# EAGLE design senseBox-HDC1080_v20 (EAGLE 7.7.0)
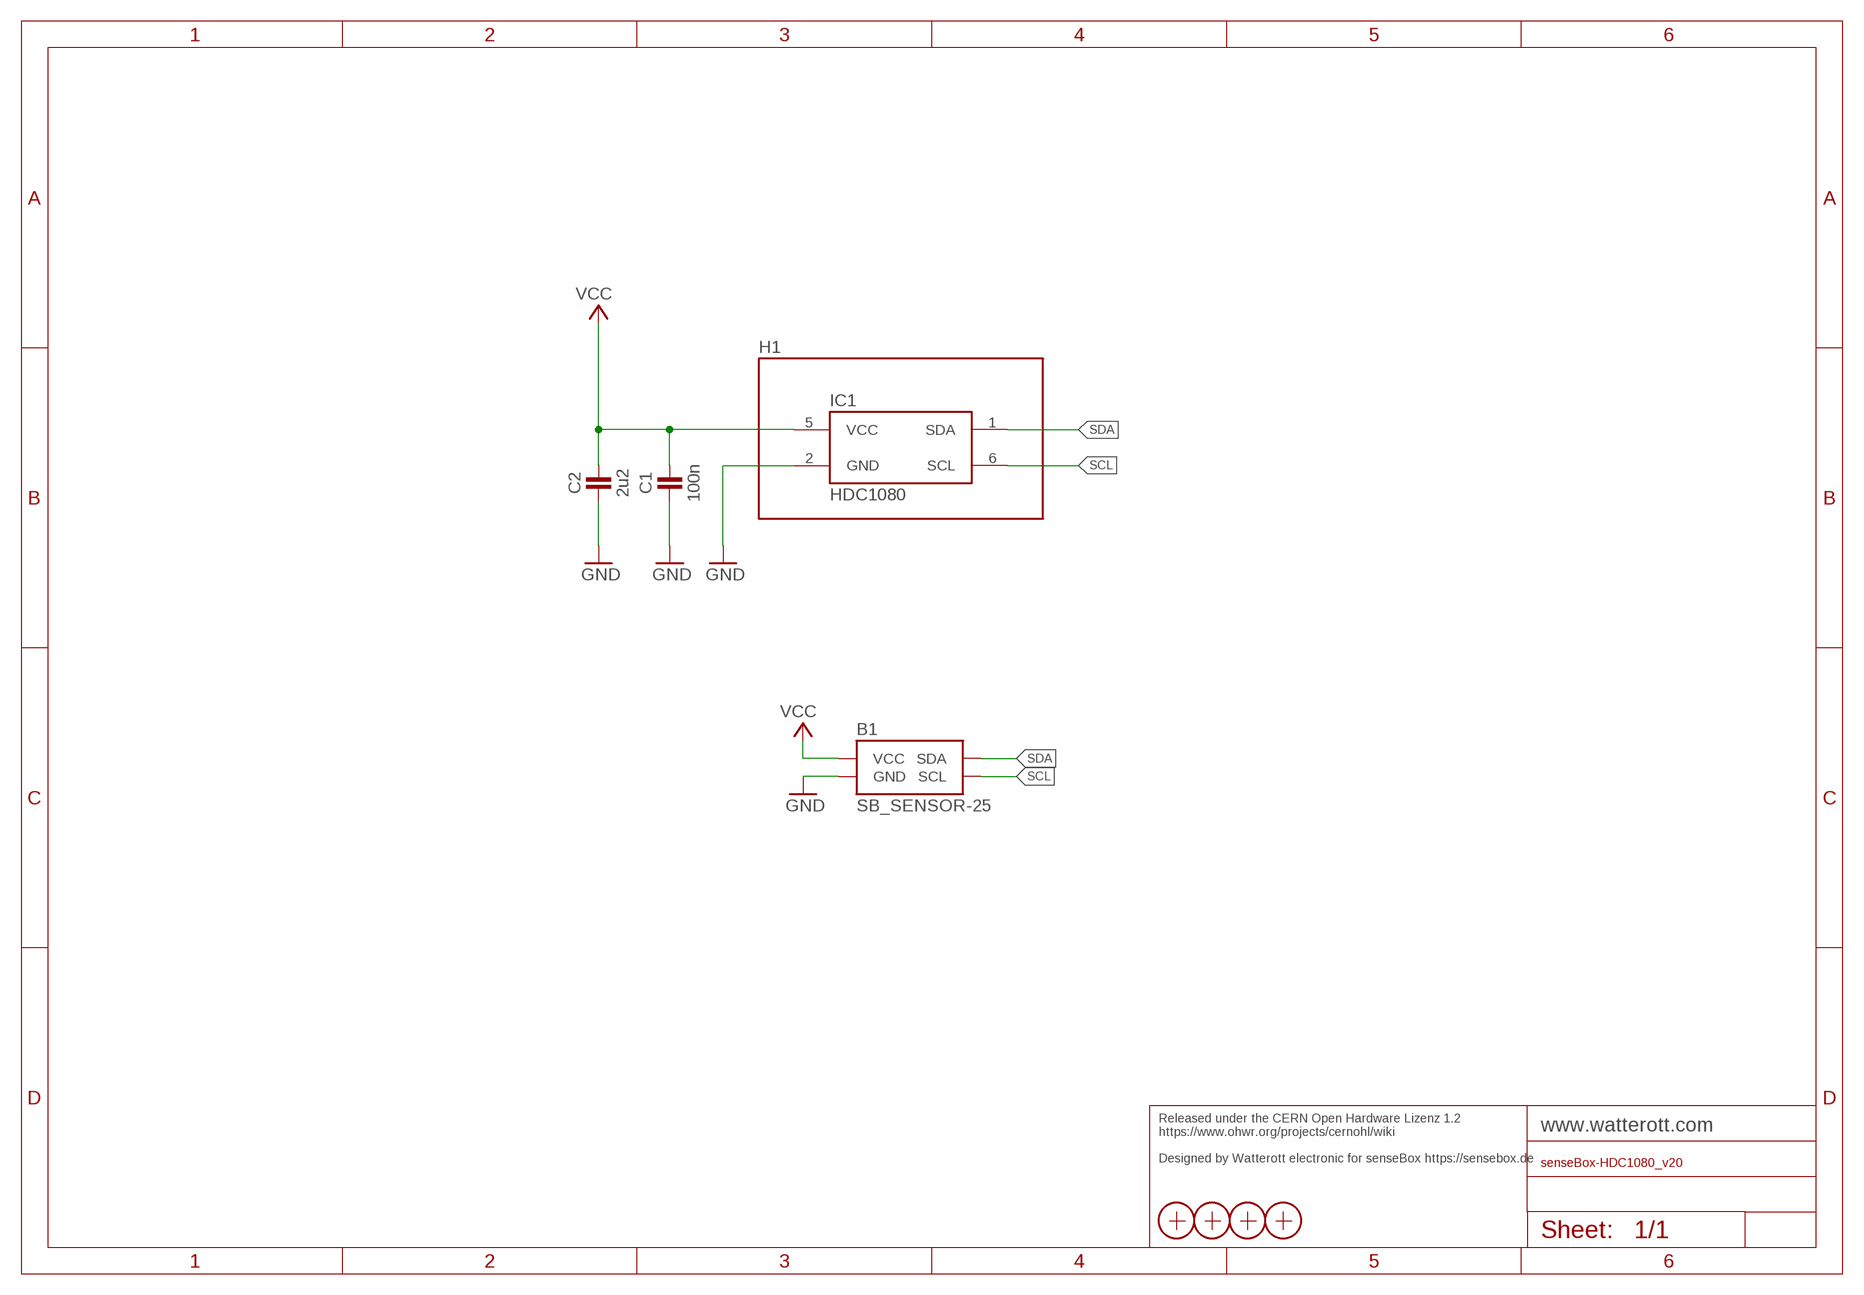
[diagram p0: schematic, sheet 1]

## Parts
B1  SB_SENSOR-25  [SB-25X25]
C1  100n  CAPACITOR-0402  [C0402]
C2  2u2  CAPACITOR-0402  [C0402]
H1  SF2  [SF2]
IC1  HDC1080  [WSON6]
X1  PASSER-07  [PASSER_07MM]
X2  PASSER-07  [PASSER_07MM]
X3  PASSER-07  [PASSER_07MM]
X4  PASSER-07  [PASSER_07MM]

## Nets
GND: B1.GND C1.1 C2.1 IC1.2(GND)
SCL: B1.SCL IC1.6(SCL)
SDA: B1.SDA IC1.1(SDA)
VCC: B1.VCC C1.2 C2.2 IC1.5(VCC)

## Notes on the sheet
- Released under the CERN Open Hardware Lizenz 1.2
  https://www.ohwr.org/projects/cernohl/wiki
  
  Designed by Watterott electronic for senseBox https://sensebox.de

## Library data of the parts
B1 = we-board:SB_SENSOR: SenseBox Sensors/Breakouts
C1 C2 = we-rcl:CAPACITOR: Capacitors ...2.2uF @ 6.3V -> 0402 ...4.7uF @ 6.3V -> 0603 ...10uF @ 16V -> 0805 ...22uF @ 25V -> 1206
H1 = we-sensor:SF2: Sensirion SF2 Filter Cab/Housing for Humidity Sensors
IC1 = we-sensor:HDC1080: TI HDC1080 Humidity and Temperature Sensor
X1-X4 = we-symbol:PASSER: Fiducial Markers

## Board
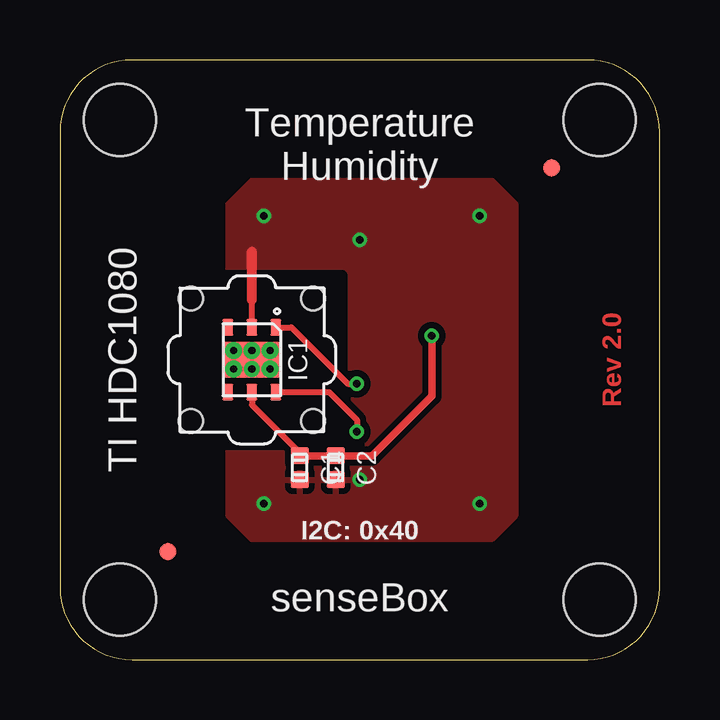
[diagram p1: board, top side]
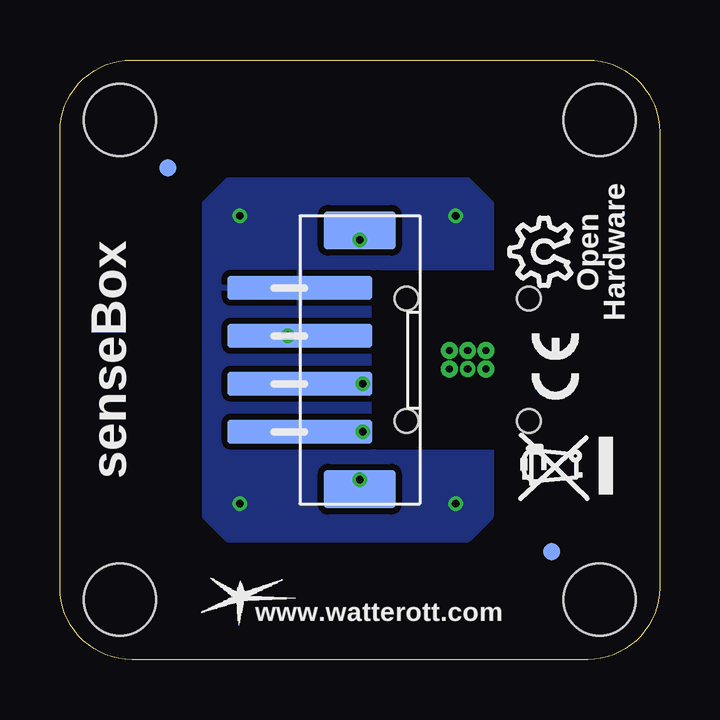
[diagram p2: board, bottom side, seen from below]

Size 25 x 25 mm. Coordinates in mm from the lower left corner, seen from the top.
Copper layers (1*16): Top 0.035mm / dielectric 1.5mm / Bottom 0.035mm
Design rules "we-dru-2-layer": minimum track width 0.15mm, minimum drill 0.3mm, track to track 0.15mm, track to pad 0.15mm, pad to pad 0.15mm, via to via 0.15mm, smd to smd 0.1mm, copper to edge 0.4mm, drill to drill 0.2mm, minimum pad ring 0.18mm, minimum via ring 0.16mm, stop-mask expansion 0.1mm, vias tented up to drill 0.5mm, thermal gap 0.25mm
tRestrict: area 4.8,9 to 11.8,16
bRestrict: area 4.8,9 to 11.8,16

### Footprints (pad centres in the part's own frame; a part is rotated, then mirrored left to right if it is on the bottom)
SB-25X25 = smd 6 x 1 bottom: GND 15,15.5; SCL 15,9.5; SDA 15,11.5; VCC 15,13.5 | smd 3 x 1.6 bottom: SHLD1 12.5,17.9; SHLD2 12.5,7.1 | hole 3: 2.5,22.5; 2.5,2.5; 22.5,22.5; 22.5,2.5
C0402 = smd 0.75 x 0.7: 1 0,0.5; 2 0,-0.5
SF2 = hole 1: -2.55,-2.55; 2.55,-2.55; 2.55,2.55; -2.55,2.55
WSON6 = smd 0.7 x 0.45: 1 -1.35,1; 2 -1.35,0; 3 -1.35,-1; 4 1.35,-1; 5 1.35,0; 6 1.35,1 | drill 0.3 pad 0.7: P$2 -0.381,0.762; P$3 0.381,0.762; P$4 -0.381,0; P$5 -0.381,-0.762; P$7 0.381,-0.762 | drill 0.3 pad 0.61: P$6 0.381,0 | smd 1.5 x 2.4: TP 0,0
PASSER_07MM = smd 0.7 x 0.7: X 0,0

### Placement (x,y rotation side)
B1  0,0 0 top
C1  10,8 180 top
C2  11.5,8 180 top
H1  8,12.5 0 top
IC1  8,12.5 270 top
X1  20.5,20.5 0 top
X2  4.5,4.5 0 top
X3  4.5,4.5 0 bottom
X4  20.5,20.5 0 bottom

### Tracks (layer width: path | path; a pad name or v marks a point on that pad's centre or on a via)
GND  (via drill 0.3)
  Top 0.254: IC1.2 8,15
  Top 0.406: 8,15 8,17
  other vias: 17.5,18.5 17.5,6.5 8.5,6.5 8.5,18.5 12.5,17.5 12.5,7.5
  pour Top (isolate 0.254): 7,19 8,20 18,20 19,19 19,6 18,5 8,5 7,6
  pour Bottom (isolate 0.254): 7,19 8,20 18,20 19,19 19,6 18,5 17,5 8,5 7,6
SCL  (via drill 0.3)
  Top 0.254: IC1.6 11.22,11.15 12.38,10 v12.38,9.5
  Bottom 0.305: v12.38,9.5 B1.SCL
SDA  (via drill 0.3)
  Top 0.254: IC1.1 9.65,13.85 12,11.5 v12.38,11.5
  Bottom 0.305: v12.38,11.5 B1.SDA
VCC  (via drill 0.3)
  Top 0.254: IC1.5 8,10.62 10,8.62 C1.2
  Top 0.305: C1.2 C2.2 13,8.5 15.5,11 v15.5,13.5
  Bottom 0.305: v15.5,13.5 B1.VCC

### Text on the board
Top: Rev 2.0
tPlace: Temperature / Humidity | TI HDC1080 | I2C: 0x40 | senseBox
Reference: 21 tPlace + 22 bPlace